# Altium schematic sheet Pump.SchDoc
size 420 x 297 mm; SheetNumber: 5; SheetTotal: 5; ProjectTitle: Prj name
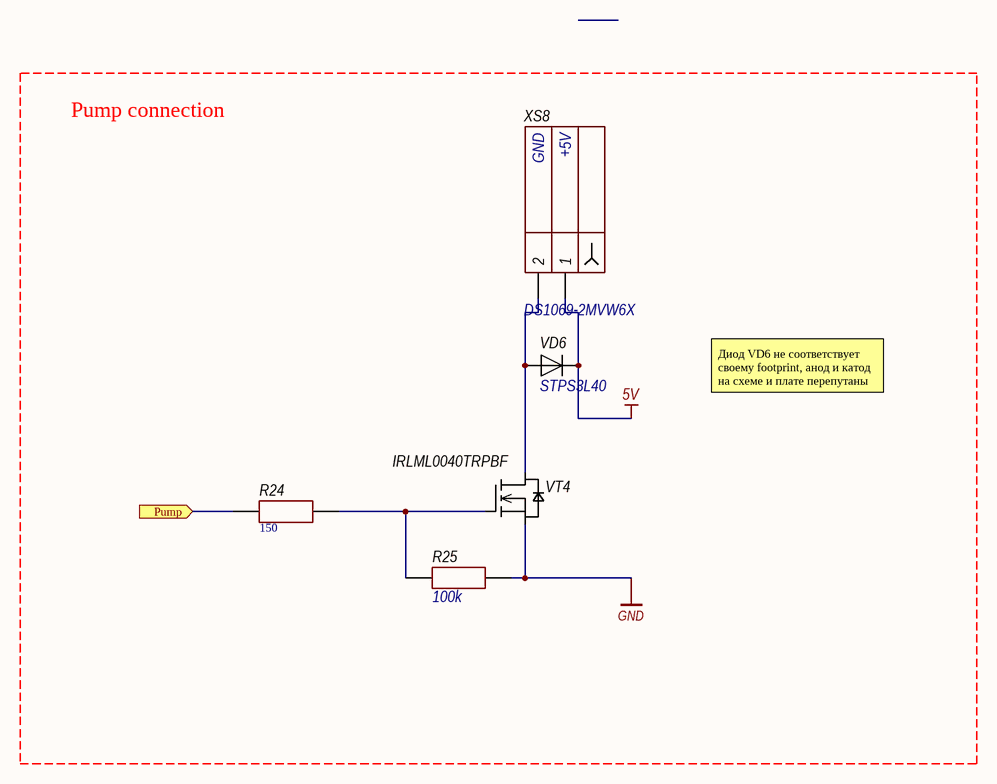
[diagram p0: Pump.SchDoc]

## Parts
R24  Resistance: 150  [RESC0603_N]  (hidden comment: RC0603FR-07150RL)
R25  Resistance: 100k  [RESC0603_N]  (hidden comment: RC0603FR-07100KL)
VD6  STPS3L40  [STPS3L40]
VT4  IRLML0040TRPBF  [SOT-23-3]
XS8  DS1069-2MVW6X  NET2: GND  NET1: +5V  [CWF-2]

## Blocks framed on the sheet
Pump connection: R24 R25 VD6 VT4 XS8

## Ports
Pump (in)

## Nets
5V: VD6.2 XS8.1
GND: R25.1 VT4.2(S)
Pump: R24.1 ; port Pump
NetR24_2: R24.2 R25.2 VT4.1(G)
NetVD6_1: VD6.1 VT4.3(D) XS8.2

## Notes on the sheet
- Диод VD6 не соответствует своему footprint, анод и катод на схеме и плате перепутаны
- Title:
- Author:
- Approved:
- Size:
- Date:
- Git Hash:
- A3
- Prj:
- Sheet
- of
- SW Version:
- Variant:
- Edited:
- CONFIDENTIAL
- File:

## Library data of the parts
R24 = CMP-RES-SMD-0393-5: RES SMD 150 OHM 1% 1/10W 0603; Manufacturer: Yageo; Max Power Dissipation: 100mW; Temperature Coefficient: ±100ppm/C°; Voltage Rating: 75V; Author: M.S. Koval; Case/Package: 0603; HelpURL: https://www.yageo.com/upload/media/product/productsearch/datasheet/rchip/PYu-RC_Group_51_RoHS_L_11.pdf; Manufacturer Part Number: RC0603FR-07150RL; Max Operating Temperature: 155°C; Min Operating Temperature: -55°C; Tolerance: 1%
R25 = CMP-RES-SMD-0462-2: RES SMD 100 KOHM 1% 1/10W 0603; Manufacturer: Yageo; Max Power Dissipation: 100mW; Temperature Coefficient: ±100ppm/C°; Voltage Rating: 75V; Author: M.S. Koval; Case/Package: 0603; HelpURL: https://www.yageo.com/upload/media/product/productsearch/datasheet/rchip/PYu-RC_Group_51_RoHS_L_11.pdf; Manufacturer Part Number: RC0603FR-07100KL; Max Operating Temperature: 155°C; Min Operating Temperature: -55°C; Tolerance: 1%
VD6 = CMP-DISCRETE-DIODES0017-2: Rectifier Diode, Schottky, 1 Phase, 1 Element, 3A, 40V V(RRM), Silicon, DO-214AB; pin to pad: 1>2 2>1; Manufacturer: ST; Forward Voltage: 400mV; Peak Non-Repetitive Surge Current: 75A; Author: v.taranov; Average Rectified Current: 3A; Case/Package: SMC; Forward Current: 3A; HelpUrl: https://www.st.com/resource/en/datasheet/stps3l40.pdf; Manufacturer Part Number: STPS3L40; Max Operating Temperature: 150°C; Min Operating Temperature: -65°C; Mount: Surface Mount; Number of Pins: 2
VT4 = CMP-DISCRETE-TRANSISTORS-MOSFET0018-2: 40V 3.6A 56mΩ@10V,3.6A 1.3W N Channel SOT-23 MOSFETs ROHS; Manufacturer: Infineon Technologies; Input Capacitance: 266pF; Rds ON Max: 78m; Theshold Voltage Vgth: 1.8V; Type: N-ch; Author: m.boltromeyuk; Continuous Drain Current ID: 3.6A; Drain to Source Voltage Vds: 40V; HelpUrl: https://www.infineon.com/dgdl/Infineon-IRLML0040-DataSheet-v01_01-EN.pdf?fileId=5546d462533600a401535664894825e4; Manufacturer Part Number: IRLML0040TRPbF; Mount: Surface mount; Power Dissipation: 1.3W
XS8 = CMP-CON-B2B-0007-3: 2.5mm, 2 pin, Male, 3A, Vertical mounting, CONNFLY; Gender: Female; Number of Contacts: 2; Voltage Rating: 250V; Author: a.antipov; Color: White; Contact Current Rating: 3A; Contact Gender: Male; Contact Plating: Tin; HelpURL: http://outer.connfly.group/static/upload/file/pdf/DS1069.pdf; Manufacturer: CONNFLY; Manufacturer Part Number: DS1069-2MVW6X; Mount: Through Hole; Orientation: Vertical; Pitch: 2.5mm